# EAGLE schematic SolderingIronDriver-V1.5-PTH (EAGLE 5.11)
LEFT: PTC; PROJECT: Soldering Iron Driver V1.5; RIGHT: K-TC
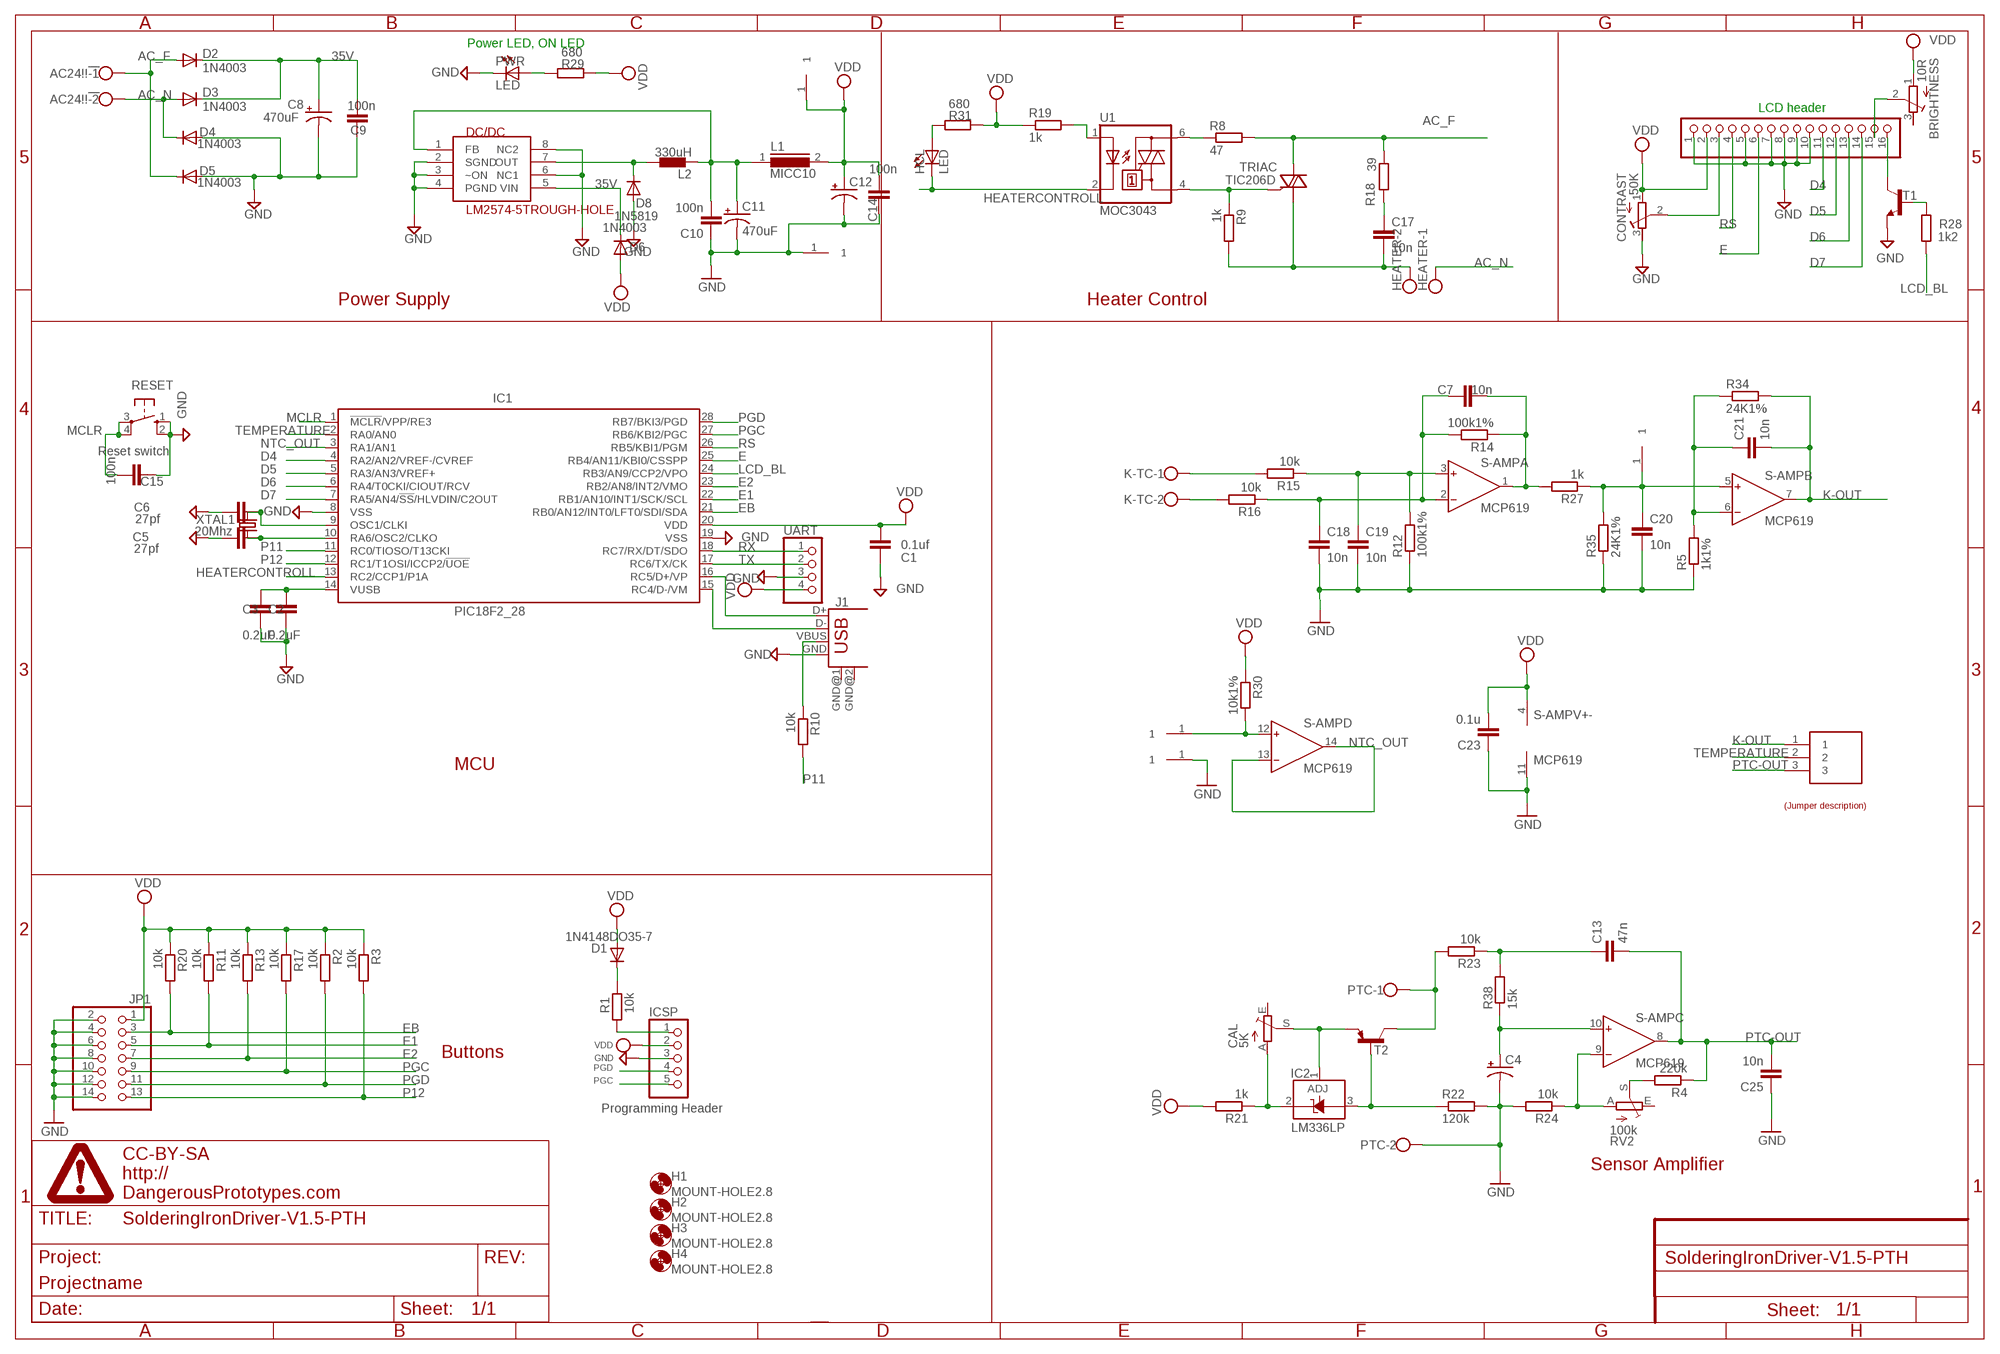
[diagram p0: schematic, sheet 1]

## Parts
5V  HEADER1X1PTH  [M1X1]
AC24!!!  W237-102  [W237-102]
AMP  HEADER1X1PTH  [M1X1]
BRIGHTNESS  10R  R-TRIMM3339P  [RTRIM3339P]
C1  0.1uf  CAPDECOUPLING  [DEC]
C2  0.2uF  CAPDECOUPLING  [DEC]
C3  0.2uF  CAPDECOUPLING  [DEC]
C4  CAP_POLPTH2  [CPOL-RADIAL-10UF-25V]
C5  27pf  CAPDECOUPLING  [DEC]
C6  27pf  CAPDECOUPLING  [DEC]
C7  10n  CAPDECOUPLING  [DEC]
C8  470uF  CAP-ELD10-P200  [CAP-D10-P200MIL]
C9  100n  CAPDECOUPLING  [DEC]
C10  100n  CAPDECOUPLING  [DEC]
C11  470uF  CAP-ELD63MP100  [CAP-D6.3MM-P100MIL]
C12  CAP_POLPTH1  [CPOL-RADIAL-100UF-25V]
C13  47n  CAPDECOUPLING  [DEC]
C14  100n  CAPDECOUPLING  [DEC]
C15  100n  CAPDECOUPLING  [DEC]
C17  10n  CAPDECOUPLING  [DEC]
C18  10n  CAPDECOUPLING  [DEC]
C19  10n  CAPDECOUPLING  [DEC]
C20  10n  CAPDECOUPLING  [DEC]
C21  10n  CAPDECOUPLING  [DEC]
C23  0.1u  CAPDECOUPLING  [DEC]
C25  10n  CAPDECOUPLING  [DEC]
CAL  5K  TRIM_EU-RJ9W  [RJ9W]
CONTRAST  50K  R-TRIMM3339P  [RTRIM3339P]
D1  1N4148DO35-7  [DO35-7]
D2  1N4003  DIODE-DO41-7.6  [DO41-7.6]
D3  1N4003  DIODE-DO41-7.6  [DO41-7.6]
D4  1N4003  DIODE-DO41-7.6  [DO41-7.6]
D5  1N4003  DIODE-DO41-7.6  [DO41-7.6]
D6  1N4003  DIODE-DO41-7.6  [DO41-7.6]
D8  1N5819  DIODE-DO41-7.6  [DO41-7.6]
DC/DC  LM2574-5TROUGH-HOLE  [DIL-08]
GND  HEADER1X1PTH  [M1X1]
H1  MOUNT-HOLE2.8  [2,8]
H2  MOUNT-HOLE2.8  [2,8]
H3  MOUNT-HOLE2.8  [2,8]
H4  MOUNT-HOLE2.8  [2,8]
HCL  LED  LED3MM  [LED3MM]
HEATER  W237-102  [W237-102]
IC1  PIC18F2_28  [SOCKET-28-3]
IC2  LM336LP  [TO92]
ICSP  PINHD-1X5  [1X05]
JP1  PINHD-2X7  [2X07]
K-TC  W237-102  [W237-102]
L1  MICC10  [MICC10]
L2  330uH  CL330UH  [CW8A]
LCD_HEADER  PINHD-1X16  [1X16]
NTC  HEADER1X1PTH  [M1X1]
ON/OFF2  HEADER1X1PTH  [M1X1]
PTC  W237-102  [W237-102]
PWR  LED  LED3MM  [LED3MM]
R1  10k  R-EU_0204/7  [0204/7]
R2  10k  RESISTORTH  [RTH025W]
R3  10k  RESISTORTH  [RTH025W]
R4  220k  RESISTORTH  [RTH025W]
R5  1k1%  RESISTORTH  [RTH025W]
R8  47  RESISTORTH  [RTH025W]
R9  1k  RESISTORTH  [RTH025W]
R10  10k  RESISTORTH  [RTH025W]
R11  10k  RESISTORTH  [RTH025W]
R12  100k1%  RESISTORTH  [RTH025W]
R13  10k  RESISTORTH  [RTH025W]
R14  100k1%  RESISTORTH  [RTH025W]
R15  10k  RESISTORTH  [RTH025W]
R16  10k  RESISTORTH  [RTH025W]
R17  10k  RESISTORTH  [RTH025W]
R18  39  RESISTORTH  [RTH025W]
R19  1k  RESISTORTH  [RTH025W]
R20  10k  RESISTORTH  [RTH025W]
R21  1k  RESISTORTH  [RTH025W]
R22  120k  RESISTORTH  [RTH025W]
R23  10k  RESISTORTH  [RTH025W]
R24  10k  RESISTORTH  [RTH025W]
R27  1k  RESISTORTH  [RTH025W]
R28  1k2  RESISTORTH  [RTH025W]
R29  680  RESISTORTH  [RTH025W]
R30  10k1%  RESISTORTH  [RTH025W]
R31  680  RESISTORTH  [RTH025W]
R34  24K1%  RESISTORTH  [RTH025W]
R35  24K1%  RESISTORTH  [RTH025W]
R38  15k  RESISTORTH  [RTH025W]
RESET  10-XX  [B3F-10XX]
RV2  100k  TRIM_EU-RJ9W  [RJ9W]
S-AMP  MCP619  [SOCKET-14]
SENSOR_SELECT  HEADER1X3PTH  [M1X3]
T1  BJT-NPNTO92ECB  [TO92-ECB]
T2  BJT-PNPTO92EBC  [TO92-EBC]
TRIAC  TIC206D  [TO220BV]
U1  MOC3043  MOC3043M  [DIL06]
U$1  DINA4_L  [DP_LOGO]
U$2  JUMP3_DESC  [JUMP3_DESC]
UART  PINHD-1X4  [1X04]
USB  USB  USB-B-H  [USB-B-H]
XTAL1  20Mhz  CRYSTALHC49U70  [HC49U70]

## Nets
35V: C8.+ C9.2 D2.C D3.C D6.C DC/DC.5(VIN)
AC_F: AC24!!!.1 D2.A D5.C R8.2 R18.1 TRIAC.T2(A2)
AC_N: AC24!!!.2 D3.A D4.C HEATER.1
D4: IC1.4(RA2/AN2/VREF-/CVREF) LCD_HEADER.11
D5: IC1.5(RA3/AN3/VREF+) LCD_HEADER.12
D6: IC1.6(RA4/T0CKI/CIOUT/RCV) LCD_HEADER.13
D7: IC1.7(RA5/AN4/!SS!/HLVDIN/C2OUT) LCD_HEADER.14
E: IC1.25(RB4/AN11/KBI0/CSSPP) LCD_HEADER.6
E1: IC1.22(RB1/AN10/INT1/SCK/SCL) JP1.5 R11.2
E2: IC1.23(RB2/AN8/INT2/VMO) JP1.7 R13.2
EB: IC1.21(RB0/AN12/INT0/LFT0/SDI/SDA) JP1.3 R20.2
GND: C1.2 C2.2 C3.2 C4.2(-) C5.2 C6.2 C8.- C9.1 C10.1 C11.- C12.2(-) C14.1 C15.1 C18.2 C19.2 C20.2 C23.1 C25.1 CONTRAST.3(A) D4.A D5.A D8.A DC/DC.2(SGND) DC/DC.3(~ON) DC/DC.4(PGND) DC/DC.6(NC1) DC/DC.8(NC2) GND.1 IC1.8(VSS) IC1.19(VSS) ICSP.3 JP1.2 JP1.4 JP1.6 JP1.8 JP1.10 JP1.12 JP1.14 LCD_HEADER.1 LCD_HEADER.5 LCD_HEADER.7 LCD_HEADER.8 LCD_HEADER.9 LCD_HEADER.10 ON/OFF2.1 PTC.2 PWR.K(C) R5.1 R12.1 R22.2 R24.2 R35.1 RESET.1(S) RESET.2(S1) S-AMP.11(V+-:V-) T1.E UART.3 USB.GND
HEATERCONTROLL: HCL.K(C) IC1.13(RC2/CCP1/P1A) U1.2(C)
K-OUT: C21.2 R34.2 S-AMP.7(B:OUT) SENSOR_SELECT.1
LCD_BL: IC1.24(RB3/AN9/CCP2/VPO) R28.2
MCLR: C15.2 IC1.1(!MCLR!/VPP/RE3) ICSP.1 R1.1 RESET.3(P) RESET.4(P1)
N$1: C6.1 IC1.9(OSC1/CLKI) XTAL1.2
N$2: C5.1 IC1.10(RA6/OSC2/CLKO) XTAL1.1
N$3: R10.1 USB.VBUS
N$4: C10.2 C11.+ DC/DC.1(FB) L1.1 L2.1
N$5: R28.1 T1.B
N$6: HCL.A R31.1
N$7: R4.2 RV2.S
N$10: D1.C R1.2
N$11: LCD_HEADER.16 T1.C
N$12: BRIGHTNESS.2(S) LCD_HEADER.15
N$14: C2.1 C3.1 IC1.14(VUSB)
N$16: K-TC.1 R15.2
N$17: CAL.S IC2.1(ADJ) T2.E
N$19: C17.1 R18.2
N$20: R9.1 TRIAC.G U1.4(A1)
N$21: R8.1 U1.6(A2)
N$22: R19.2 U1.1(A)
N$23: C13.1 R23.1 R38.2
N$24: NTC.1 R30.2 S-AMP.12(D:IN+)
N$25: K-TC.2 R16.2
N$26: C7.1 C18.1 R14.2 R16.1 S-AMP.2(A:IN-)
N$27: C19.1 R12.2 R15.1 S-AMP.3(A:IN+)
N$28: C7.2 R14.1 R27.2 S-AMP.1(A:OUT)
N$29: IC2.3(A) R22.1 T2.B
N$30: CAL.A IC2.2(C) R21.1
N$31: AMP.1 C20.1 R27.1 R35.2 S-AMP.5(B:IN+)
N$32: C21.1 R5.2 R34.1 S-AMP.6(B:IN-)
N$33: C4.1(+) R38.1 S-AMP.10(C:IN+)
N$34: PTC.1 R23.2 T2.C
N$37: R24.1 RV2.A S-AMP.9(C:IN-)
N$38: PWR.A R29.1
N$46: CONTRAST.2(S) LCD_HEADER.3
NTC_OUT: IC1.3(RA1/AN1) S-AMP.13(D:IN-) S-AMP.14(D:OUT)
P11: IC1.11(RC0/TIOSO/T13CKI) R10.2
P12: IC1.12(RC1/T1OSI/ICCP2/!UOE) JP1.13 R3.2
PGC: IC1.27(RB6/KBI2/PGC) ICSP.5 JP1.9 R17.2
PGD: IC1.28(RB7/BKI3/PGD) ICSP.4 JP1.11 R2.2
PTC-OUT: C13.2 C25.2 R4.1 S-AMP.8(C:OUT) SENSOR_SELECT.3
RC4: IC1.15(RC4/D-/VM) USB.D-
RC5: IC1.16(RC5/D+/VP) USB.D+
RS: IC1.26(RB5/KBI1/PGM) LCD_HEADER.4
RX: IC1.18(RC7/RX/DT/SDO) UART.1
SW-OUT: D8.C DC/DC.7(OUT) L2.2
TEMPERATURE: IC1.2(RA0/AN0) SENSOR_SELECT.2
TX: IC1.17(RC6/TX/CK) UART.2
VDD: 5V.1 BRIGHTNESS.1(E) C1.1 C12.1(+) C14.2 C23.2 CONTRAST.1(E) D1.A D6.A IC1.20(VDD) ICSP.2 JP1.1 L1.2 LCD_HEADER.2 R2.1 R3.1 R11.1 R13.1 R17.1 R19.1 R20.1 R21.2 R29.2 R30.1 R31.2 S-AMP.4(V+-:V+) UART.4
WHATEVER: C17.2 HEATER.2 R9.2 TRIAC.T1(A1)
Unconnected: BRIGHTNESS.3(A) CAL.E RV2.E USB.GND@1(GND) USB.GND@2(GND)

## Notes on the sheet
- Power LED, ON LED
- LCD header
- Power Supply | Heater Control
- Reset switch
- J1
- MCU
- Buttons
- Programming Header
- Sensor Amplifier

## Library data of the parts
5V AMP GND NTC ON/OFF2 = dp_devices:HEADER1X1
AC24!!! HEATER K-TC PTC = con-wago-500:W237-102: WAGO SCREW CLAMP; MPN: 237-102; OC_FARNELL: unknown; OC_NEWARK: 70K9898
BRIGHTNESS CONTRAST = rcl:R-TRIMM: Trimm resistor
C1-C3 C5-C7 C9 C10 C13-C15 C17-C21 C23 C25 = dp_devices:CAP
C4 C12 = SparkFun:CAP_POL: Capacitor Polarized These are standard SMD and PTH capacitors. Normally 10uF, 47uF, and 100uF in electrolytic and tantalum varieties. Always verify the external diameter of the through hole cap, it varies with capacity, voltage, and manufacturer. The EIA devices should be standard.
C8 C11 = fica:CAP-EL
CAL RV2 = fica2:TRIM_EU-: POTENTIOMETER
D1 = diode:1N4148: DIODE high speed (Philips)
D2-D6 D8 = diode:DIODE-: DIODE
DC/DC = fica:LM2574-5
H1-H4 = holes:MOUNT-HOLE: MOUNTING HOLE with drill center marker
HCL PWR = led:LED: LED OSRAM: - CHIPLED LG R971, LG N971, LY N971, LG Q971, LY Q971, LO R971, LY R971 LH N974, LH R974 LS Q976, LO Q976, LY Q976 LO Q996 - Hyper CHIPLED LW Q18S LB Q993, LB Q99A, LB R99A - SideLED LS A670, LO A670, LY A670, LG A670, LP A670 LB A673, LV A673, LT A673, LW A673 LH A674 LY A675 LS A676, LA A676, LO A676, LY A676, LW A676 LS A679, LY A679, LG A679 - Hyper Micro SIDELED® LS Y876, LA Y876, LO Y876, LY Y876 LT Y87S - SmartLED LW L88C, LW L88S LB L89C, LB L89S, LG L890 LS L89K, LO L89K, LY L89K LS L896, LA L896, LO L896, LY L896 - TOPLED LS T670, LO T670, LY T670, LG T670, LP T670 LSG T670, LSP T670, LSY T670, LOP T670, LYG T670 LG T671, LOG T671, LSG T671 LB T673, LV T673, LT T673, LW T673 LH T674 LS T676, LA T676, LO T676, LY T676, LB T676, LH T676, LSB T676, LW T676 LB T67C, LV T67C, LT T67C, LS T67K, LO T67K, LY T67K, LW E67C LS E67B, LA E67B, LO E67B, LY E67B, LB E67C, LV E67C, LT E67C LW T67C LS T679, LY T679, LG T679 LS T770, LO T770, LY T770, LG T770, LP T770 LB T773, LV T773, LT T773, LW T773 LH T774 LS E675, LA E675, LY E675, LS T675 LS T776, LA T776, LO T776, LY T776, LB T776 LHGB T686 LT T68C, LB T68C - Hyper Mini TOPLED® LB M676 - Mini TOPLED Santana® LG M470 LS M47K, LO M47K, LY M47K Source: http://www.osram.convergy.de LUXEON: - LUMILED® LXK2-PW12-R00, LXK2-PW12-S00, LXK2-PW14-U00, LXK2-PW14-V00 LXK2-PM12-R00, LXK2-PM12-S00, LXK2-PM14-U00 LXK2-PE12-Q00, LXK2-PE12-R00, LXK2-PE12-S00, LXK2-PE14-T00, LXK2-PE14-U00 LXK2-PB12-K00, LXK2-PB12-L00, LXK2-PB12-M00, LXK2-PB14-N00, LXK2-PB14-P00, LXK2-PB14-Q00 LXK2-PR12-L00, LXK2-PR12-M00, LXK2-PR14-Q00, LXK2-PR14-R00 LXK2-PD12-Q00, LXK2-PD12-R00, LXK2-PD12-S00 LXK2-PH12-R00, LXK2-PH12-S00 LXK2-PL12-P00, LXK2-PL12-Q00, LXK2-PL12-R00 Source: www.luxeon.com KINGBRIGHT: KA-3528ASYC Source: www.kingbright.com
IC1 = microchip:PIC18F2*_28: USB Microcontrollers with nanoWatt Technology High-Performance, Enhanced Flash, 28/40/44-Pin, Source: http://ww1.microchip.com/downloads/en/devicedoc/39632c.pdf
IC2 = linear:LM336: 2.5-V INTEGRATED REFERENCE CIRCUITS LM236 Source: http://focus.ti.com/lit/ds/symlink/lm336-2.5.pdf
ICSP = pinhead-2:PINHD-1X5: PIN HEADER
JP1 = pinhead:PINHD-2X7: PIN HEADER
L1 = inductors:MICC10: INDUCTOR
L2 = fica:CL330UH
LCD_HEADER = fica:PINHD-1X16: PIN HEADER
R1 = rcl:R-EU_: RESISTOR, European symbol
R2-R5 R8-R24 R27-R31 R34 R35 R38 = dp_devices:RESISTOR
RESET = switch-omron:10-XX: OMRON SWITCH; MPN: B3F-1000; OC_FARNELL: 176432; OC_NEWARK: 36M3542
S-AMP = fica2:MCP619
SENSOR_SELECT = DP2:HEADER1X3
T1 = dp_devices:BJT-NPN: Most commonly used is SOT23-BEC
T2 = DP2:BJT-PNP: Most commonly used is SOT23-BEC
TRIAC = triac:TIC206: TRIAC Source: http://www.bourns.com/pdfs/tic206.pdf
U1 = optocoupler:MOC30*: 6-Pin DIP Zero-Cross Optoisolators Triac Driver Output (250/400 Volt Peak) Source: http://www.fairchildsemi.com/ds/MO/MOC3043-M.pdf; MF: FAIRCHILD SEMICONDUCTOR; MPN: MOC3043-M; OC_FARNELL: 1021371; OC_NEWARK: 72K8900
U$1 = DP2:DINA4_L: A4 DP frame Standard Dangerous Prototypes schematic frame. Automagically adds the DP logo and standard texts to the PCB Use the atrribute in the schematic editor to change the fields.; FF1: fulfillment by; FF2: Seeed Studio; FF3: www.seeedstudio.com; LICENSE: CC-BY-SA; PROJECT: Projectname; URL1: http://; URL2: DangerousPrototypes.com
U$2 = DP2:JUMP3_DESC: Nice formatted three legged jumperdescription Use attributes to change the values LEFT = With jumper to the left RIGHT = With jumper to the right; LEFT: left; RIGHT: right
UART = pinhead:PINHD-1X4: PIN HEADER
USB = con-usb-2:USB: USB Connectors
XTAL1 = crystal:CRYSTAL: CRYSTAL; OC_FARNELL: unknown; OC_NEWARK: unknown